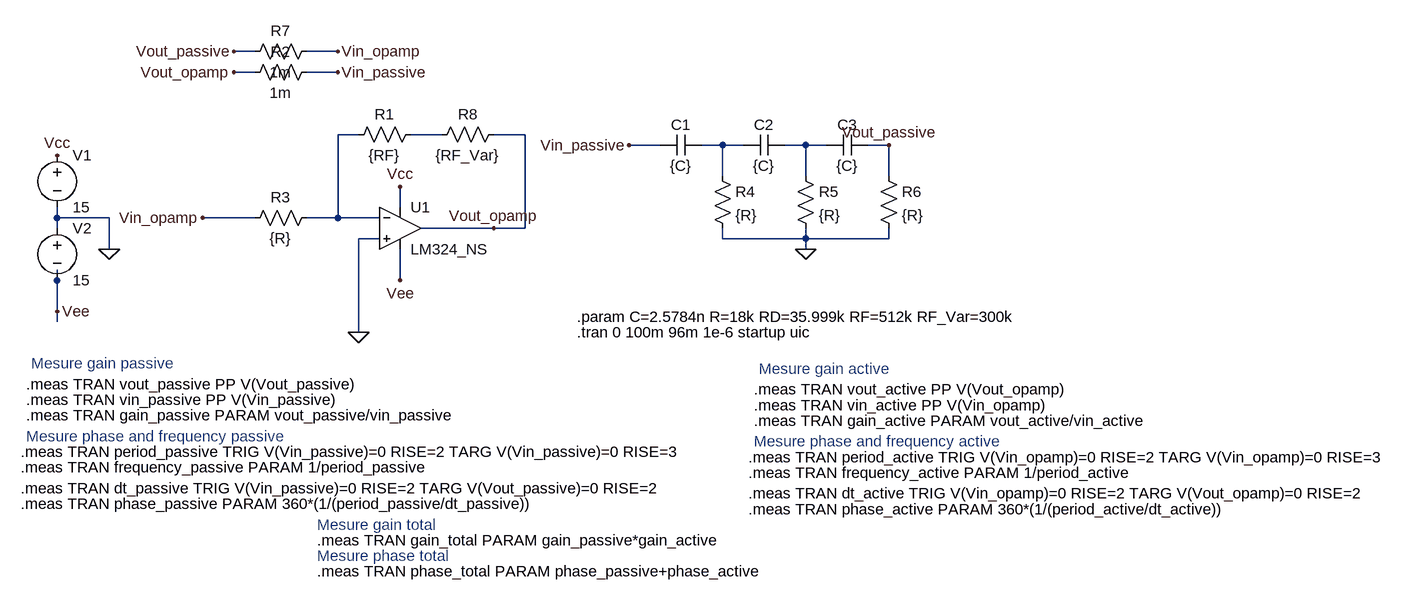
[diagram p0: schematic 3-ajuste_potenciometro.asc]
3-ajuste_potenciometro.asc, the LTspice schematic file:
Version 4
SHEET 1 2052 752
WIRE -32 -160 -64 -160
WIRE 96 -160 48 -160
WIRE -32 -128 -64 -128
WIRE 96 -128 48 -128
WIRE 128 -32 96 -32
WIRE 256 -32 208 -32
WIRE 384 -32 336 -32
WIRE 592 -16 544 -16
WIRE 688 -16 656 -16
WIRE 720 -16 688 -16
WIRE 816 -16 784 -16
WIRE 848 -16 816 -16
WIRE 944 -16 912 -16
WIRE 688 32 688 -16
WIRE 816 32 816 -16
WIRE 944 32 944 -16
WIRE 192 80 192 48
WIRE -336 96 -336 80
WIRE -256 96 -336 96
WIRE -32 96 -112 96
WIRE 96 96 96 -32
WIRE 96 96 48 96
WIRE 160 96 96 96
WIRE -336 112 -336 96
WIRE 336 112 224 112
WIRE 384 112 384 -32
WIRE 384 112 336 112
WIRE 160 128 128 128
WIRE 688 128 688 112
WIRE 816 128 816 112
WIRE 816 128 688 128
WIRE 944 128 944 112
WIRE 944 128 816 128
WIRE -256 144 -256 96
WIRE 816 144 816 128
WIRE -336 192 -336 176
WIRE 192 192 192 144
WIRE -336 240 -336 192
WIRE -336 256 -336 240
WIRE 128 272 128 128
FLAG -336 0 Vcc
FLAG -336 240 Vee
FLAG -256 144 0
FLAG 128 272 0
FLAG 816 144 0
FLAG 944 -16 Vout_passive
FLAG 192 192 Vee
FLAG 192 48 Vcc
FLAG 336 112 Vout_opamp
FLAG 544 -16 Vin_passive
FLAG -112 96 Vin_opamp
FLAG 96 -160 Vin_opamp
FLAG 96 -128 Vin_passive
FLAG -64 -128 Vout_opamp
FLAG -64 -160 Vout_passive
SYMBOL res 224 -48 R90
WINDOW 0 0 56 VBottom 2
WINDOW 3 32 56 VTop 2
SYMATTR InstName R1
SYMATTR Value {RF}
SYMBOL voltage -336 -16 R0
WINDOW 123 0 0 Left 0
WINDOW 39 0 0 Left 0
SYMATTR InstName V1
SYMATTR Value 15
SYMBOL voltage -336 96 R0
WINDOW 123 0 0 Left 0
WINDOW 39 0 0 Left 0
SYMATTR InstName V2
SYMATTR Value 15
SYMBOL res 64 80 R90
WINDOW 0 0 56 VBottom 2
WINDOW 3 32 56 VTop 2
SYMATTR InstName R3
SYMATTR Value {R}
SYMBOL cap 656 -32 R90
WINDOW 0 0 32 VBottom 2
WINDOW 3 32 32 VTop 2
SYMATTR InstName C1
SYMATTR Value {C}
SYMBOL cap 784 -32 R90
WINDOW 0 0 32 VBottom 2
WINDOW 3 32 32 VTop 2
SYMATTR InstName C2
SYMATTR Value {C}
SYMBOL cap 912 -32 R90
WINDOW 0 0 32 VBottom 2
WINDOW 3 32 32 VTop 2
SYMATTR InstName C3
SYMATTR Value {C}
SYMBOL res 672 16 R0
SYMATTR InstName R4
SYMATTR Value {R}
SYMBOL res 800 16 R0
SYMATTR InstName R5
SYMATTR Value {R}
SYMBOL res 928 16 R0
SYMATTR InstName R6
SYMATTR Value {R}
SYMBOL EXTRA\\ExtraOpamps\\LM324_NS 192 112 R0
SYMATTR InstName U1
SYMBOL res 64 -144 R90
WINDOW 0 0 56 VBottom 2
WINDOW 3 32 56 VTop 2
SYMATTR InstName R2
SYMATTR Value 1m
SYMBOL res 64 -176 R90
WINDOW 0 0 56 VBottom 2
WINDOW 3 32 56 VTop 2
SYMATTR InstName R7
SYMATTR Value 1m
SYMBOL res 352 -48 R90
WINDOW 0 0 56 VBottom 2
WINDOW 3 32 56 VTop 2
SYMATTR InstName R8
SYMATTR Value {RF_Var}
TEXT 464 248 Left 2 !.param C=2.5784n R=18k RD=35.999k RF=512k RF_Var=300k
TEXT 464 272 Left 2 !.tran 0 100m 96m 1e-6 startup uic
TEXT -384 352 Left 2 !.meas TRAN vout_passive PP V(Vout_passive)
TEXT -384 400 Left 2 !.meas TRAN gain_passive PARAM vout_passive/vin_passive
TEXT -392 536 Left 2 !.meas TRAN phase_passive PARAM 360*(1/(period_passive/dt_passive))
TEXT -392 456 Left 2 !.meas TRAN period_passive TRIG V(Vin_passive)=0 RISE=2 TARG V(Vin_passive)=0 RISE=3
TEXT -392 512 Left 2 !.meas TRAN dt_passive TRIG V(Vin_passive)=0 RISE=2 TARG V(Vout_passive)=0 RISE=2
TEXT -376 320 Left 2 ;Mesure gain passive
TEXT -384 432 Left 2 ;Mesure phase and frequency passive
TEXT -392 480 Left 2 !.meas TRAN frequency_passive PARAM 1/period_passive
TEXT -384 376 Left 2 !.meas TRAN vin_passive PP V(Vin_passive)
TEXT 736 360 Left 2 !.meas TRAN vout_active PP V(Vout_opamp)
TEXT 736 408 Left 2 !.meas TRAN gain_active PARAM vout_active/vin_active
TEXT 728 544 Left 2 !.meas TRAN phase_active PARAM 360*(1/(period_active/dt_active))
TEXT 728 464 Left 2 !.meas TRAN period_active TRIG V(Vin_opamp)=0 RISE=2 TARG V(Vin_opamp)=0 RISE=3
TEXT 728 520 Left 2 !.meas TRAN dt_active TRIG V(Vin_opamp)=0 RISE=2 TARG V(Vout_opamp)=0 RISE=2
TEXT 744 328 Left 2 ;Mesure gain active
TEXT 736 440 Left 2 ;Mesure phase and frequency active
TEXT 728 488 Left 2 !.meas TRAN frequency_active PARAM 1/period_active
TEXT 736 384 Left 2 !.meas TRAN vin_active PP V(Vin_opamp)
TEXT 64 568 Left 2 ;Mesure gain total
TEXT 64 592 Left 2 !.meas TRAN gain_total PARAM gain_passive*gain_active
TEXT 64 640 Left 2 !.meas TRAN phase_total PARAM phase_passive+phase_active
TEXT 64 616 Left 2 ;Mesure phase total

The netlist it stands for:
* 3-ajuste_potenciometro.asc
R1 N002 N001 {RF}
V1 Vcc 0 15
V2 0 Vee 15
R3 N001 Vin_opamp {R}
C1 N003 Vin_passive {C}
C2 N004 N003 {C}
C3 Vout_passive N004 {C}
R4 N003 0 {R}
R5 N004 0 {R}
R6 Vout_passive 0 {R}
* U1: LM324_NS (symbol EXTRA\ExtraOpamps\LM324_NS not available, pins judged from their places): In+=0 In-=N001 V+=Vcc V-=Vee OUT=Vout_opamp
R2 Vin_passive Vout_opamp 1m
R7 Vin_opamp Vout_passive 1m
R8 Vout_opamp N002 {RF_Var}
.param C=2.5784n R=18k RD=35.999k RF=512k RF_Var=300k
.tran 0 100m 96m 1e-6 startup uic
.meas TRAN vout_passive PP V(Vout_passive)
.meas TRAN gain_passive PARAM vout_passive/vin_passive
.meas TRAN phase_passive PARAM 360*(1/(period_passive/dt_passive))
.meas TRAN period_passive TRIG V(Vin_passive)=0 RISE=2 TARG V(Vin_passive)=0 RISE=3
.meas TRAN dt_passive TRIG V(Vin_passive)=0 RISE=2 TARG V(Vout_passive)=0 RISE=2
* Mesure gain passive
* Mesure phase and frequency passive
.meas TRAN frequency_passive PARAM 1/period_passive
.meas TRAN vin_passive PP V(Vin_passive)
.meas TRAN vout_active PP V(Vout_opamp)
.meas TRAN gain_active PARAM vout_active/vin_active
.meas TRAN phase_active PARAM 360*(1/(period_active/dt_active))
.meas TRAN period_active TRIG V(Vin_opamp)=0 RISE=2 TARG V(Vin_opamp)=0 RISE=3
.meas TRAN dt_active TRIG V(Vin_opamp)=0 RISE=2 TARG V(Vout_opamp)=0 RISE=2
* Mesure gain active
* Mesure phase and frequency active
.meas TRAN frequency_active PARAM 1/period_active
.meas TRAN vin_active PP V(Vin_opamp)
* Mesure gain total
.meas TRAN gain_total PARAM gain_passive*gain_active
.meas TRAN phase_total PARAM phase_passive+phase_active
* Mesure phase total
.backanno
.end